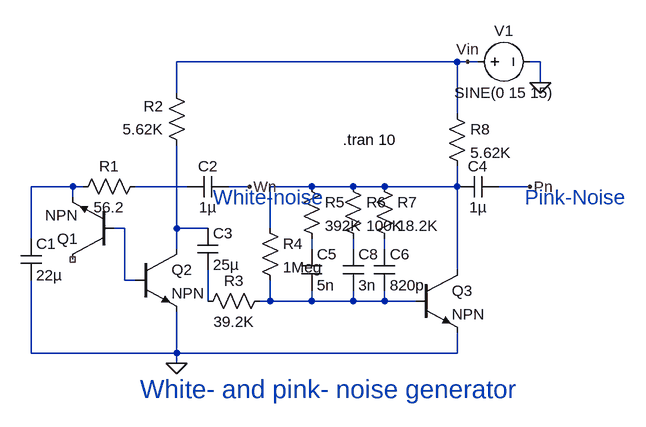
[diagram p0: schematic white-pink-noise-generator.asc]
white-pink-noise-generator.asc, the LTspice schematic file:
Version 4.1
SHEET 1 904 680
WIRE 672 0 240 0
WIRE 688 0 672 0
WIRE 704 0 688 0
WIRE 800 0 784 0
WIRE 800 32 800 0
WIRE 240 48 240 0
WIRE 672 80 672 0
WIRE 80 192 16 192
WIRE 96 192 80 192
WIRE 256 192 176 192
WIRE 352 192 320 192
WIRE 448 192 384 192
WIRE 512 192 448 192
WIRE 560 192 512 192
WIRE 672 192 672 160
WIRE 672 192 560 192
WIRE 784 192 736 192
WIRE 80 208 80 192
WIRE 160 256 144 256
WIRE 240 256 240 128
WIRE 288 256 240 256
WIRE 384 256 384 192
WIRE 16 272 16 192
WIRE 240 288 240 256
WIRE 448 288 448 272
WIRE 512 288 512 272
WIRE 560 288 560 272
WIRE 672 320 672 192
WIRE 160 336 160 256
WIRE 176 336 160 336
WIRE 288 368 288 320
WIRE 384 368 384 336
WIRE 384 368 368 368
WIRE 448 368 448 352
WIRE 448 368 384 368
WIRE 512 368 512 352
WIRE 512 368 448 368
WIRE 560 368 560 352
WIRE 560 368 512 368
WIRE 608 368 560 368
WIRE 16 448 16 336
WIRE 240 448 240 384
WIRE 240 448 16 448
WIRE 672 448 672 416
WIRE 672 448 240 448
WIRE 240 464 240 448
FLAG 240 464 0
FLAG 800 32 0
FLAG 352 192 Wn
FLAG 784 192 Pn
FLAG 688 0 Vin
SYMBOL npn 144 304 R180
SYMATTR InstName Q1
SYMBOL npn 176 288 R0
SYMATTR InstName Q2
SYMBOL npn 608 320 R0
SYMATTR InstName Q3
SYMBOL cap 0 272 R0
SYMATTR Value 22µ
SYMATTR InstName C1
SYMATTR SpiceLine V=25 Irms=0 Rser=0.2 Lser=0 mfg="AVX" pn="TPSD226M025R0200" type="Tantalum"
SYMBOL cap 256 208 R270
WINDOW 0 32 32 VTop 2
WINDOW 3 0 32 VBottom 2
SYMATTR InstName C2
SYMATTR Value 1µ
SYMATTR SpiceLine V=16 Irms=0 Rser=11 Lser=0 mfg="AVX" pn="TAJA105K016" type="Tantalum"
SYMBOL cap 272 256 R0
SYMATTR InstName C3
SYMATTR Value 25µ
SYMATTR SpiceLine V=16 Irms=0 Rser=1.6 Lser=0
SYMBOL res 192 176 R90
WINDOW 0 0 56 VBottom 2
WINDOW 3 32 56 VTop 2
SYMATTR InstName R1
SYMATTR Value 56.2
SYMATTR SpiceLine tol=1 pwr=0.1
SYMBOL res 256 144 R180
WINDOW 0 36 76 Left 2
WINDOW 3 36 40 Left 2
SYMATTR InstName R2
SYMATTR Value 5.62K
SYMATTR SpiceLine tol=1 pwr=0.1
SYMBOL res 272 384 R270
WINDOW 0 32 56 VTop 2
WINDOW 3 0 56 VBottom 2
SYMATTR InstName R3
SYMATTR Value 39.2K
SYMATTR SpiceLine tol=1 pwr=0.1
SYMBOL res 368 240 R0
SYMATTR InstName R4
SYMATTR Value 1Meg
SYMATTR SpiceLine tol=1 pwr=0.1
SYMBOL res 432 176 R0
SYMATTR InstName R5
SYMATTR Value 392K
SYMATTR SpiceLine tol=1 pwr=0.1
SYMBOL res 496 176 R0
SYMATTR InstName R6
SYMATTR Value 100K
SYMATTR SpiceLine tol=1 pwr=0.1
SYMBOL res 544 176 R0
SYMATTR InstName R7
SYMATTR Value 18.2K
SYMATTR SpiceLine tol=1 pwr=0.1
SYMBOL cap 672 208 R270
WINDOW 0 32 32 VTop 2
WINDOW 3 0 32 VBottom 2
SYMATTR InstName C4
SYMATTR Value 1µ
SYMATTR SpiceLine V=16 Irms=0 Rser=11 Lser=0 mfg="AVX" pn="TAJA105K016" type="Tantalum"
SYMBOL res 656 64 R0
SYMATTR InstName R8
SYMATTR Value 5.62K
SYMATTR SpiceLine tol=1 pwr=0.1
SYMBOL voltage 688 0 R270
WINDOW 0 32 56 VTop 2
WINDOW 3 -32 56 VBottom 2
WINDOW 123 0 0 Left 0
WINDOW 39 0 0 Left 0
SYMATTR InstName V1
SYMATTR Value SINE(0 15 15)
SYMBOL cap 432 288 R0
SYMATTR Value 5n
SYMATTR InstName C5
SYMATTR SpiceLine V=16 Irms=0 Rser=11 Lser=0
SYMBOL cap 496 288 R0
SYMATTR Value 3n
SYMATTR InstName C8
SYMATTR SpiceLine V=16 Irms=0 Rser=11 Lser=0
SYMBOL cap 544 288 R0
SYMATTR Value 820p
SYMATTR InstName C6
SYMATTR SpiceLine V=16 Irms=0 Rser=11 Lser=0
TEXT 776 208 Left 3 ;Pink-Noise
TEXT 296 208 Left 3 ;White-noise
TEXT 184 504 Left 4 ;White- and pink- noise generator
TEXT 496 120 Left 2 !.tran 10

The netlist it stands for:
* white-pink-noise-generator.asc
Q1 NC_01 N004 N001 0 NPN
Q2 N005 N004 0 0 NPN
Q3 N003 N010 0 0 NPN
C1 N001 0 22µ V=25 Irms=0 Rser=0.2 Lser=0 mfg="AVX" pn="TPSD226M025R0200" type="Tantalum"
C2 N002 Wn 1µ V=16 Irms=0 Rser=11 Lser=0 mfg="AVX" pn="TAJA105K016" type="Tantalum"
C3 N005 N009 25µ V=16 Irms=0 Rser=1.6 Lser=0
R1 N002 N001 56.2 tol=1 pwr=0.1
R2 N005 Vin 5.62K tol=1 pwr=0.1
R3 N009 N010 39.2K tol=1 pwr=0.1
R4 N003 N010 1Meg tol=1 pwr=0.1
R5 N003 N006 392K tol=1 pwr=0.1
R6 N003 N007 100K tol=1 pwr=0.1
R7 N003 N008 18.2K tol=1 pwr=0.1
C4 N003 Pn 1µ V=16 Irms=0 Rser=11 Lser=0 mfg="AVX" pn="TAJA105K016" type="Tantalum"
R8 Vin N003 5.62K tol=1 pwr=0.1
V1 Vin 0 SINE(0 15 15)
C5 N006 N010 5n V=16 Irms=0 Rser=11 Lser=0
C8 N007 N010 3n V=16 Irms=0 Rser=11 Lser=0
C6 N008 N010 820p V=16 Irms=0 Rser=11 Lser=0
.model NPN NPN
.model PNP PNP
.lib standard.bjt
* Pink-Noise
* White-noise
* White- and pink- noise generator
.tran 10
.backanno
.end